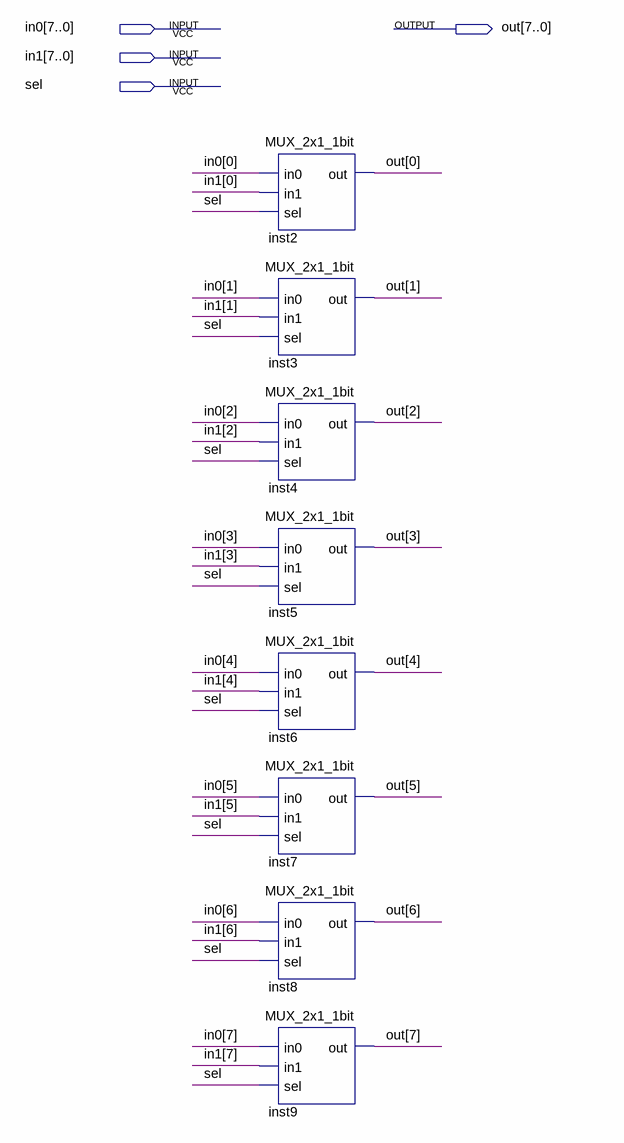
[diagram p0: schematic sheet]
// Quartus schematic MUX_2x1_8b.bdf as structural Verilog: 8 symbols, 4 pins
module MUX_2x1_8b (
  input  [7:0] in0,
  input  [7:0] in1,
  input  sel,
  output [7:0] out
);

  MUX_2x1_1bit inst2 (.in0(in0[0]), .in1(in1[0]), .sel(sel), .out(out[0]));
  MUX_2x1_1bit inst3 (.in0(in0[1]), .in1(in1[1]), .sel(sel), .out(out[1]));
  MUX_2x1_1bit inst4 (.in0(in0[2]), .in1(in1[2]), .sel(sel), .out(out[2]));
  MUX_2x1_1bit inst5 (.in0(in0[3]), .in1(in1[3]), .sel(sel), .out(out[3]));
  MUX_2x1_1bit inst6 (.in0(in0[4]), .in1(in1[4]), .sel(sel), .out(out[4]));
  MUX_2x1_1bit inst7 (.in0(in0[5]), .in1(in1[5]), .sel(sel), .out(out[5]));
  MUX_2x1_1bit inst8 (.in0(in0[6]), .in1(in1[6]), .sel(sel), .out(out[6]));
  MUX_2x1_1bit inst9 (.in0(in0[7]), .in1(in1[7]), .sel(sel), .out(out[7]));
endmodule
